# Altium schematic sheet AFE.SchDoc
size A4
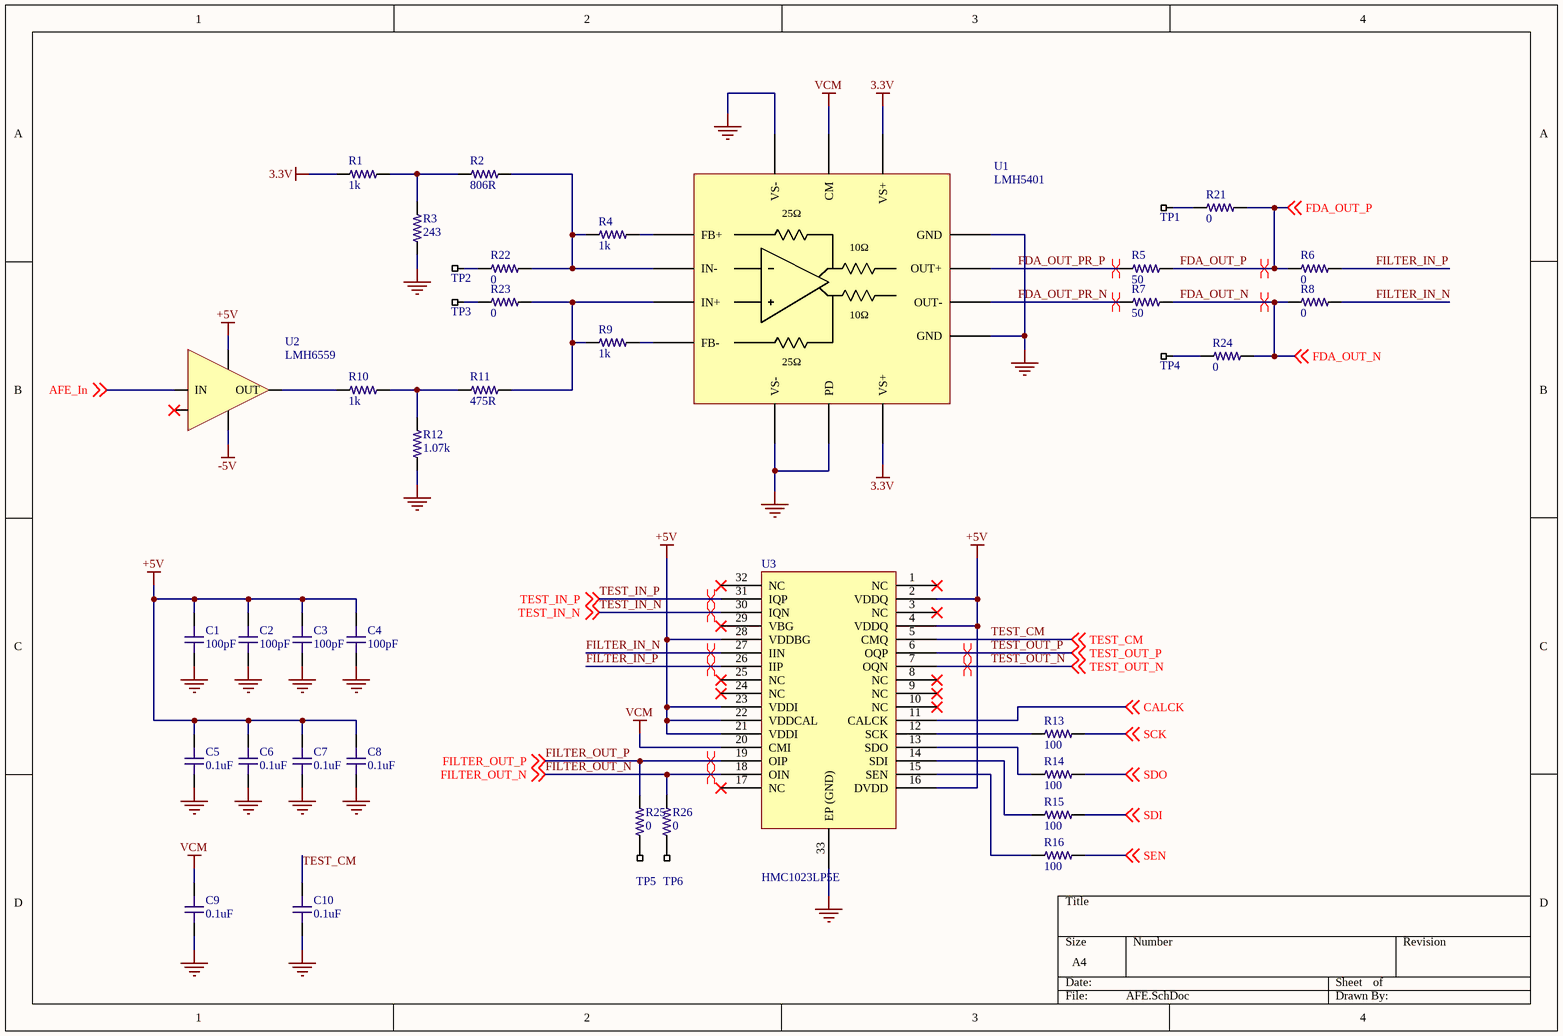
[diagram p0: AFE.SchDoc]

## Parts
C1  value 100pF  [C0402-IPC]  (hidden comment: C0402 100pF 50V C0G)
C2  value 100pF  [C0402-IPC]  (hidden comment: C0402 100pF 50V C0G)
C3  value 100pF  [C0402-IPC]  (hidden comment: C0402 100pF 50V C0G)
C4  value 100pF  [C0402-IPC]  (hidden comment: C0402 100pF 50V C0G)
C5  value 0.1uF  [C0402-HIGH-DENSITY]  (hidden comment: GRM155R71H104KE14D)
C6  value 0.1uF  [C0402-HIGH-DENSITY]  (hidden comment: GRM155R71H104KE14D)
C7  value 0.1uF  [C0402-HIGH-DENSITY]  (hidden comment: GRM155R71H104KE14D)
C8  value 0.1uF  [C0402-HIGH-DENSITY]  (hidden comment: GRM155R71H104KE14D)
C9  value 0.1uF  [C0402-HIGH-DENSITY]  (hidden comment: GRM155R71H104KE14D)
C10  value 0.1uF  [C0402-HIGH-DENSITY]  (hidden comment: GRM155R71H104KE14D)
R1  value 1k  [R0402-HIGH-DENSITY]  (hidden comment: R0402 1k 1%)
R2  806R  [R0603-HIGH-DENSITY]
R3  value 243  [R0603-IPC]  (hidden comment: R0603 243 1%)
R4  value 1k  [R0402-HIGH-DENSITY]  (hidden comment: R0402 1k 1%)
R5  value 50  [R0402-HIGH-DENSITY]  (hidden comment: R0402 51 1%)
R6  value 0  [R0402-HIGH-DENSITY]  (hidden comment: R0402 0R)
R7  value 50  [R0402-HIGH-DENSITY]  (hidden comment: R0402 51 1%)
R8  value 0  [R0402-HIGH-DENSITY]  (hidden comment: R0402 0R)
R9  value 1k  [R0402-HIGH-DENSITY]  (hidden comment: R0402 1k 1%)
R10  value 1k  [R0402-HIGH-DENSITY]  (hidden comment: R0402 1k 1%)
R11  475R  [R0402-HIGH-DENSITY]
R12  1.07k  [R0603-HIGH-DENSITY]
R13  value 100  [R0402-HIGH-DENSITY]  (hidden comment: R0402 100R 1%)
R14  value 100  [R0402-HIGH-DENSITY]  (hidden comment: R0402 100R 1%)
R15  value 100  [R0402-HIGH-DENSITY]  (hidden comment: R0402 100R 1%)
R16  value 100  [R0402-HIGH-DENSITY]  (hidden comment: R0402 100R 1%)
R21  value 0  [R0402-HIGH-DENSITY]  (hidden comment: R0402 0R)
R22  value 0  [R0402-HIGH-DENSITY]  (hidden comment: R0402 0R)
R23  value 0  [R0402-HIGH-DENSITY]  (hidden comment: R0402 0R)
R24  value 0  [R0402-HIGH-DENSITY]  (hidden comment: R0402 0R)
R25  value 0  [R0402-HIGH-DENSITY]  (hidden comment: R0402 0R)
R26  value 0  [R0402-HIGH-DENSITY]  (hidden comment: R0402 0R)
TP1  Testpoint_SMT  [TESTPOINT_SMT]  (value not drawn)  (no BOM)
TP2  Testpoint_SMT  [TESTPOINT_SMT]  (value not drawn)  (no BOM)
TP3  Testpoint_SMT  [TESTPOINT_SMT]  (value not drawn)  (no BOM)
TP4  Testpoint_SMT  [TESTPOINT_SMT]  (value not drawn)  (no BOM)
TP5  Testpoint_SMT  [TESTPOINT_SMT]  (value not drawn)  (no BOM)
TP6  Testpoint_SMT  [TESTPOINT_SMT]  (value not drawn)  (no BOM)
U1  LMH5401  [LMH5401]
U2  LMH6559  [LMH6559]
U3  HMC1023LP5E  [HMC1023]

## Nets
3.3V: R1.1 U1.1(VS+) U1.10(VS+)
+5V: C1.2 C2.2 C3.2 C4.2 C5.2 C6.2 C7.2 C8.2 U2.5(V+) U3.2(VDDQ) U3.4(VDDQ) U3.16(DVDD) U3.21(VDDI) U3.22(VDDCAL) U3.23(VDDI) U3.28(VDDBG)
-5V: U2.2(V-)
GND: C1.1 C2.1 C3.1 C4.1 C5.1 C6.1 C7.1 C8.1 C9.1 C10.1 R3.1 R12.1 U1.3(VS-) U1.8(VS-) U1.9(PD) U1.11(GND) U1.14(GND) U3.33(EP_(GND))
VCM: C9.2 U1.2(CM) U3.20(CMI)
AFE_In: U2.4(IN) ; off-sheet AFE_In
CALCK: U3.11(CALCK) ; off-sheet CALCK
FDA_OUT_N: R7.2 R8.1 R24.2 ; off-sheet FDA_OUT_N
FDA_OUT_P: R5.2 R6.1 R21.2 ; off-sheet FDA_OUT_P
FDA_OUT_PR_N: R7.1 U1.12(OUT-)
FDA_OUT_PR_P: R5.1 U1.13(OUT+)
FILTER_IN_N: R8.2 U3.27(IIN)
FILTER_IN_P: R6.2 U3.26(IIP)
FILTER_OUT_N: R26.2 U3.18(OIN) ; off-sheet FILTER_OUT_N
FILTER_OUT_P: R25.2 U3.19(OIP) ; off-sheet FILTER_OUT_P
SCK: R13.2 ; off-sheet SCK
SDI: R15.2 ; off-sheet SDI
SDO: R14.2 ; off-sheet SDO
SEN: R16.2 ; off-sheet SEN
TEST_CM: C10.2 U3.5(CMQ) ; off-sheet TEST_CM
TEST_IN_N: U3.30(IQN) ; off-sheet TEST_IN_N
TEST_IN_P: U3.31(IQP) ; off-sheet TEST_IN_P
TEST_OUT_N: U3.7(OQN) ; off-sheet TEST_OUT_N
TEST_OUT_P: U3.6(OQP) ; off-sheet TEST_OUT_P
NetR1_2: R1.2 R2.1 R3.2
NetR2_2: R2.2 R4.1 R22.2 U1.5(IN-)
NetR4_2: R4.2 U1.4(FB+)
NetR9_1: R9.1 R11.2 R23.2 U1.6(IN+)
NetR9_2: R9.2 U1.7(FB-)
NetR10_1: R10.1 U2.1(OUT)
NetR10_2: R10.2 R11.1 R12.2
NetR13_1: R13.1 U3.12(SCK)
NetR14_1: R14.1 U3.13(SDO)
NetR15_1: R15.1 U3.14(SDI)
NetR16_1: R16.1 U3.15(SEN)
NetR21_1: R21.1 TP1.1
NetR22_1: R22.1 TP2.1
NetR23_1: R23.1 TP3.1
NetR24_1: R24.1 TP4.1
NetR25_1: R25.1 TP5.1
NetR26_1: R26.1 TP6.1

Not connected (* = marked no-connect by the designer): U2 3(NC)*; U3 1(NC)* 3(NC)* 8(NC)* 9(NC)* 10(NC)* 17(NC)* 24(NC)* 25(NC)* 29(VBG)* 32(NC)*

## Layout directives
differential pair: FDA_OUT_N, FDA_OUT_P, FDA_OUT_PR_N, FDA_OUT_PR_P, FILTER_IN_N, FILTER_IN_P, FILTER_OUT_N, FILTER_OUT_P, TEST_IN_N, TEST_IN_P, TEST_OUT_N, TEST_OUT_P

## Notes on the sheet
- (in symbol LMH5401) 25Ω; 10Ω

## Library data of the parts
C1-C4 = C0402 100pF 50V C0G: Chip Capacitor, 0402, 100p, 1%, 50V, C0G; Max. Voltage: 50V; EIA Code: C0G; Supplier 1: Digi-Key; Supplier Part Number 1: 490-7753-1-ND
C5-C10 = C0402 0.1uF 50V X7R: Chip Capacitor, 0402, 0.10uF, 50V, X7R; Supplier 1: Digi-Key; Supplier Part Number 1: 490-10700-1-ND
R1 R4 R9 R10 = R0402 1k 1%: Chip Resistor, 0402, 1k ohms, 1%, 1/16 W; Supplier 1: Digi-Key; Supplier Part Number 1: 311-1.00KLRCT-ND
R2 = 806R 0603 0.5% 1/10W: RES 806 OHM 0.5% 1/10W 0603; Manufacturer: Stackpole Electronics; Manufacturer Part Number: RNCF0603DTE806R; Power Rating: 63mW; Supplier 1: Digi-Key; RoHS: Yes; Category: Chip SMD Resistors; Stock 1: 7286; Pricing 1: 1=0.13000, 10=0.11000, 100=0.04300, 1000=0.01800, 2500=0.01650 (USD); Mount: Surface Mount; Case/Package: 0603; Min Operating Temperature: -55°C; Max Operating Temperature: 155°C; Resistance: 806R; Tolerance: 0.5%; Packaging: Tape and Reel; RoHS Compliant: Yes; ComponentLink1URL: https://www.seielect.com/catalog/sei-rncf.pdf?src-supplier=Digi-Key; ComponentLink1Description: https://www.seielect.com/catalog/sei-rncf.pdf?src-supplier=Digi-Key; Supplier Part Number 1: RNCF0603DTE806RCT-ND
R3 = R0603 243 1%: RES SMD 243 OHM 1% 1/10W 0603; Temperature Coefficient: ±100ppm/°C; Tolerance: ±1%; Features: Automotive AEC-Q200; Operating Temperature: -55°C ~ 155°C; Supplier 1: Digi-Key; Supplier Part Number 1: RMCF0603FT243RCT-ND
R5 R7 = R0402 51 1%: Chip Resistor, 0402, 50 ohms, 1%, 1/10 W
R6 R8 R21-R26 = R0402 0R: Chip Resistor, 0402, 0 ohm jumper; Supplier 1: Digi-Key; Supplier Part Number 1: 311-0.0JRCT-ND
R11 = 475R 0402 1% 1/5W: RES SMD 475 OHM 1% 1/5W 0402; Manufacturer: Vishay Dale; Manufacturer Part Number: CRCW0402475RFKEDHP; Max Power Dissipation: 125mW; Temperature Coefficient: 100ppm/°C; Supplier 1: Digi-Key; RoHS: Yes; Category: Chip SMD Resistors; Stock 1: 9500; Pricing 1: 1=0.14000, 10=0.12600, 100=0.04840, 1000=0.02130, 2500=0.01839, 5000=0.01646 (USD); Case/Package: 0402; Contact Plating: Tin; Min Operating Temperature: -55°C; Max Operating Temperature: 155°C; Resistance: 475R; Tolerance: 1%; Package Quantity: 10000; Packaging: Tape and Reel; Resistor Type: Thick Film; Number of Terminations: 2; Features: Automotive AEC-Q200; Series: CRCW-HP; Length: 0.039inch; Width: 0.02inch; Height: 0.016inch; Radiation Hardening: No; Lead Free: Lead Free; RoHS Compliant: Yes; ComponentLink1URL: https://datasheet.ciiva.com/8898/crcwhpe3-8898762.pdf?src-supplier=Avnet; ComponentLink1Description: https://datasheet.ciiva.com/8898/crcwhpe3-8898762.pdf?src-supplier=Avnet; ComponentLink2URL: https://datasheet.ciiva.com/2573/crcwhpe3-2573100.pdf?src-supplier=Digi-Key; ComponentLink2Description: https://datasheet.ciiva.com/2573/crcwhpe3-2573100.pdf?src-supplier=Digi-Key; Supplier Part Number 1: 541-CRCW0402475RFKEDHPCT-ND
R12 = 1.07k 0603 1% 1/10W: RES SMD 1.07K OHM 1% 1/10W 0603; Manufacturer: Stackpole Electronics; Manufacturer Part Number: RMCF0603FT1K07; Resistance: 1.07kR; Max Power Dissipation: 100mW; Temperature Coefficient: 100ppm/°C; Supplier 1: Digi-Key; RoHS: Yes; Category: Chip SMD Resistors; Stock 1: 16341; Pricing 1: 1=0.10000, 10=0.01600, 100=0.00650, 1000=0.00292, 2500=0.00253 (USD); Mount: Surface Mount; Case/Package: 0603; Case Code (Metric): 1608; Case Code (Imperial): 0603; Contact Plating: Tin,Matte; Min Operating Temperature: -55°C; Max Operating Temperature: 155°C; Packaging: Tape and Reel; Tolerance: 1%; Resistor Type: Thick Film; Number of Terminations: 2; Features: Automotive AEC-Q200; Series: RMCF; Length: 0.061inch; Width: 0.031inch; Height: 0.022inch; Radiation Hardening: No; Lead Free: Lead Free; RoHS Compliant: Yes; ComponentLink1URL: https://www.seielect.com/catalog/SEI-RMCF_RMCP.pdf?src-supplier=Avnet; ComponentLink1Description: https://www.seielect.com/catalog/SEI-RMCF_RMCP.pdf?src-supplier=Avnet; ComponentLink2URL: https://www.seielect.com/Catalog/SEI-RMCF_RMCP.pdf?src-supplier=Digi-Key; ComponentLink2Description: https://www.seielect.com/Catalog/SEI-RMCF_RMCP.pdf?src-supplier=Digi-Key; ComponentLink3URL: https://www.seielect.com/catalog/SEI-Packaging.pdf?src-supplier=Digi-Key; ComponentLink3Description: https://www.seielect.com/catalog/SEI-Packaging.pdf?src-supplier=Digi-Key; Supplier Part Number 1: RMCF0603FT1K07CT-ND
R13-R16 = R0402 100R 1%: Chip Resistor, 0402, 100 ohms, 1%, 1/16 W; Supplier 1: Digi-Key; Supplier Part Number 1: 311-100LRCT-ND
TP1-TP6 = Testpoint_SMT: SMT Test Point
U1 = LMH5401: TEXAS INSTRUMENTS - LMH5401IRMST - DIFF AMP, 6.2GHZ, 17.5KV/US, UQFN-14; Min Supply Voltage: 3.15V; Max Supply Voltage: 5.25V; Min Dual Supply Voltage: 1.575V; Max Dual Supply Voltage: 2.625V; Number of Circuits: 1; Slew Rate: 17500V/µs; Gain Bandwidth Product: 8GHz; -3db Bandwidth: 1.2GHz; Operating Supply Current: 55mA; Output Current per Channel: 50mA; Frequency: 2GHz; Gain: 6dB; Operating Supply Voltage: 5V; Supplier 1: Digi-Key; Manufacturer: Texas Instruments; Manufacturer Part Number: LMH5401IRMST; RoHS: Yes; Category: Amplifiers - Op Amps, Buffer, Instrumentation; Stock 1: 1716; Pricing 1: 1=17.26000, 10=15.86500, 25=15.20760, 100=12.74150 (USD); Mount: Surface Mount; Number of Pins: 14; Weight: 0.000353oz; Min Operating Temperature: -40°C; Max Operating Temperature: 85°C; Packaging: Tape and Reel; Number of Amplifiers: 1; Bandwidth: 8GHz; Number of Channels: 1; Package Quantity: 250; REACH SVHC: No SVHC; Lead Free: Lead Free; RoHS Compliant: Yes; ComponentLink1URL: https://datasheet.ciiva.com/48505/lmh5401-48505045.pdf?src-supplier=Avnet; ComponentLink1Description: https://datasheet.ciiva.com/48505/lmh5401-48505045.pdf?src-supplier=Avnet; Supplier Part Number 1: 296-38513-1-ND
U2 = LMH6559: OP Amp Buffer Single GP 10V 5-Pin SOT-23 T/R; Manufacturer: TI National Semiconductor; Manufacturer Part Number: LMH6559MF/NOPB; Min Supply Voltage: 3V; Voltage Gain: 59.98dB; Output Current: 75mA; Number of Channels: 1; Slew Rate: 4580V/µs; Nominal Supply Current: 10mA; Operating Supply Voltage: 5V; Input Bias Current: 3uA; Input Offset Voltage (Vos): 3mV; Output Current per Channel: 74mA; Min Dual Supply Voltage: 1.5V; Power Supply Rejection Ratio (PSRR): 44dB; -3db Bandwidth: 1.75GHz; Supplier 1: Digi-Key; RoHS: No; Category: Amplifiers - Op Amps, Buffer, Instrumentation; Stock 1: 2784; Pricing 1: 1=2.89000, 10=2.59800, 25=2.45640, 100=2.01980, 250=1.81240, 500=1.74688 (USD); Mount: Surface Mount; Case/Package: SOT-23; Number of Pins: 5; Min Operating Temperature: -40°C; Max Operating Temperature: 85°C; Max Supply Voltage: 10V; Packaging: Tape and Reel; Package Quantity: 1000; Number of Circuits: 1; Supply Current: 10mA; Amplifier Type: BUFFER; Number of Elements: 1; Series: -; Number of Amplifiers: 1; Bandwidth: 1.75GHz; Termination: SMD/SMT; Length: 2.92mm; Width: 1.6mm; Height: 1.02mm; Radiation Hardening: No; Lead Free: Lead Free; REACH SVHC: No SVHC; ComponentLink1URL: https://datasheet.ciiva.com/15130/getdatasheetpartid-68437-15130143.pdf?src-supplier=Verical; ComponentLink1Description: https://datasheet.ciiva.com/15130/getdatasheetpartid-68437-15130143.pdf?src-supplier=Verical; ComponentLink2URL: https://datasheet.ciiva.com/2975/lmh6559-2975204.pdf?src-supplier=Avnet; ComponentLink2Description: https://datasheet.ciiva.com/2975/lmh6559-2975204.pdf?src-supplier=Avnet; ComponentLink3URL: https://datasheet.ciiva.com/2975/lmh6559-2975205.pdf?src-supplier=Avnet; ComponentLink3Description: https://datasheet.ciiva.com/2975/lmh6559-2975205.pdf?src-supplier=Avnet; ComponentLink4URL: https://datasheet.ciiva.com/6630/lmh6559-6630632.pdf?src-supplier=Digi-Key; ComponentLink4Description: https://datasheet.ciiva.com/6630/lmh6559-6630632.pdf?src-supplier=Digi-Key; ComponentLink5URL: https://datasheet.ciiva.com/6630/lmh6559-6630633.pdf?src-supplier=Digi-Key; ComponentLink5Description: https://datasheet.ciiva.com/6630/lmh6559-6630633.pdf?src-supplier=Digi-Key; ComponentLink6URL: https://datasheet.ciiva.com/6630/lmh6559-6630634.pdf?src-supplier=Digi-Key; ComponentLink6Description: https://datasheet.ciiva.com/6630/lmh6559-6630634.pdf?src-supplier=Digi-Key; ComponentLink7URL: https://datasheet.ciiva.com/4756/lmh6559-4756997.pdf?src-supplier=Mouser; ComponentLink7Description: https://datasheet.ciiva.com/4756/lmh6559-4756997.pdf?src-supplier=Mouser; ComponentLink8URL: https://datasheet.ciiva.com/14094/lmh6559-eng-tds-14094141.pdf?src-supplier=Distrelec; ComponentLink8Description: https://datasheet.ciiva.com/14094/lmh6559-eng-tds-14094141.pdf?src-supplier=Distrelec; ComponentLink9URL: https://datasheet.ciiva.com/26223/lmh6559-26223561.pdf?src-supplier=Avnet+Europe; ComponentLink9Description: https://datasheet.ciiva.com/26223/lmh6559-26223561.pdf?src-supplier=Avnet+Europe; Supplier Part Number 1: LMH6559MF/NOPBCT-ND
U3 = HMC1023LP5E: Active Filter Dual Low Pass Filter 6th Order 72MHz 32-Pin QFN Bulk; Manufacturer: Analog Devices; Operating Supply Voltage: 5V; Min Supply Voltage: 4.75V; Max Supply Voltage: 5.25V; Frequency: 100MHz; Number of Channels: 2; Supplier 1: Digi-Key; Manufacturer Part Number: HMC1023LP5E; RoHS: Yes; Category: Integrated Circuits (ICs); Stock 1: 38; Pricing 1: 1=25.14000, 10=24.35000, 25=23.56480, 50=22.77960, 100=21.99400, 250=20.89432 (USD); Mount: Surface Mount; Case/Package: QFN; Number of Pins: 32; Weight: 0.006653oz; Contact Plating: Tin,Matte; Min Operating Temperature: -40°C; Max Operating Temperature: 85°C; Packaging: Cut Tape; Package Quantity: 1; Bandwidth: 72MHz; Number of Circuits: 2; Max Frequency: 72MHz; Length: 0.197inch; Width: 0.197inch; Height: 0.039inch; REACH SVHC: Unknown; Lead Free: Contains Lead; RoHS Compliant: Yes; ComponentLink1URL: https://datasheet.ciiva.com/29361/hmc1023lp5-29361744.pdf?src-supplier=Digi-Key; ComponentLink1Description: https://datasheet.ciiva.com/29361/hmc1023lp5-29361744.pdf?src-supplier=Digi-Key; Supplier Part Number 1: 1127-1662-ND